# Altium schematic sheet preamp.SchDoc
size Letter
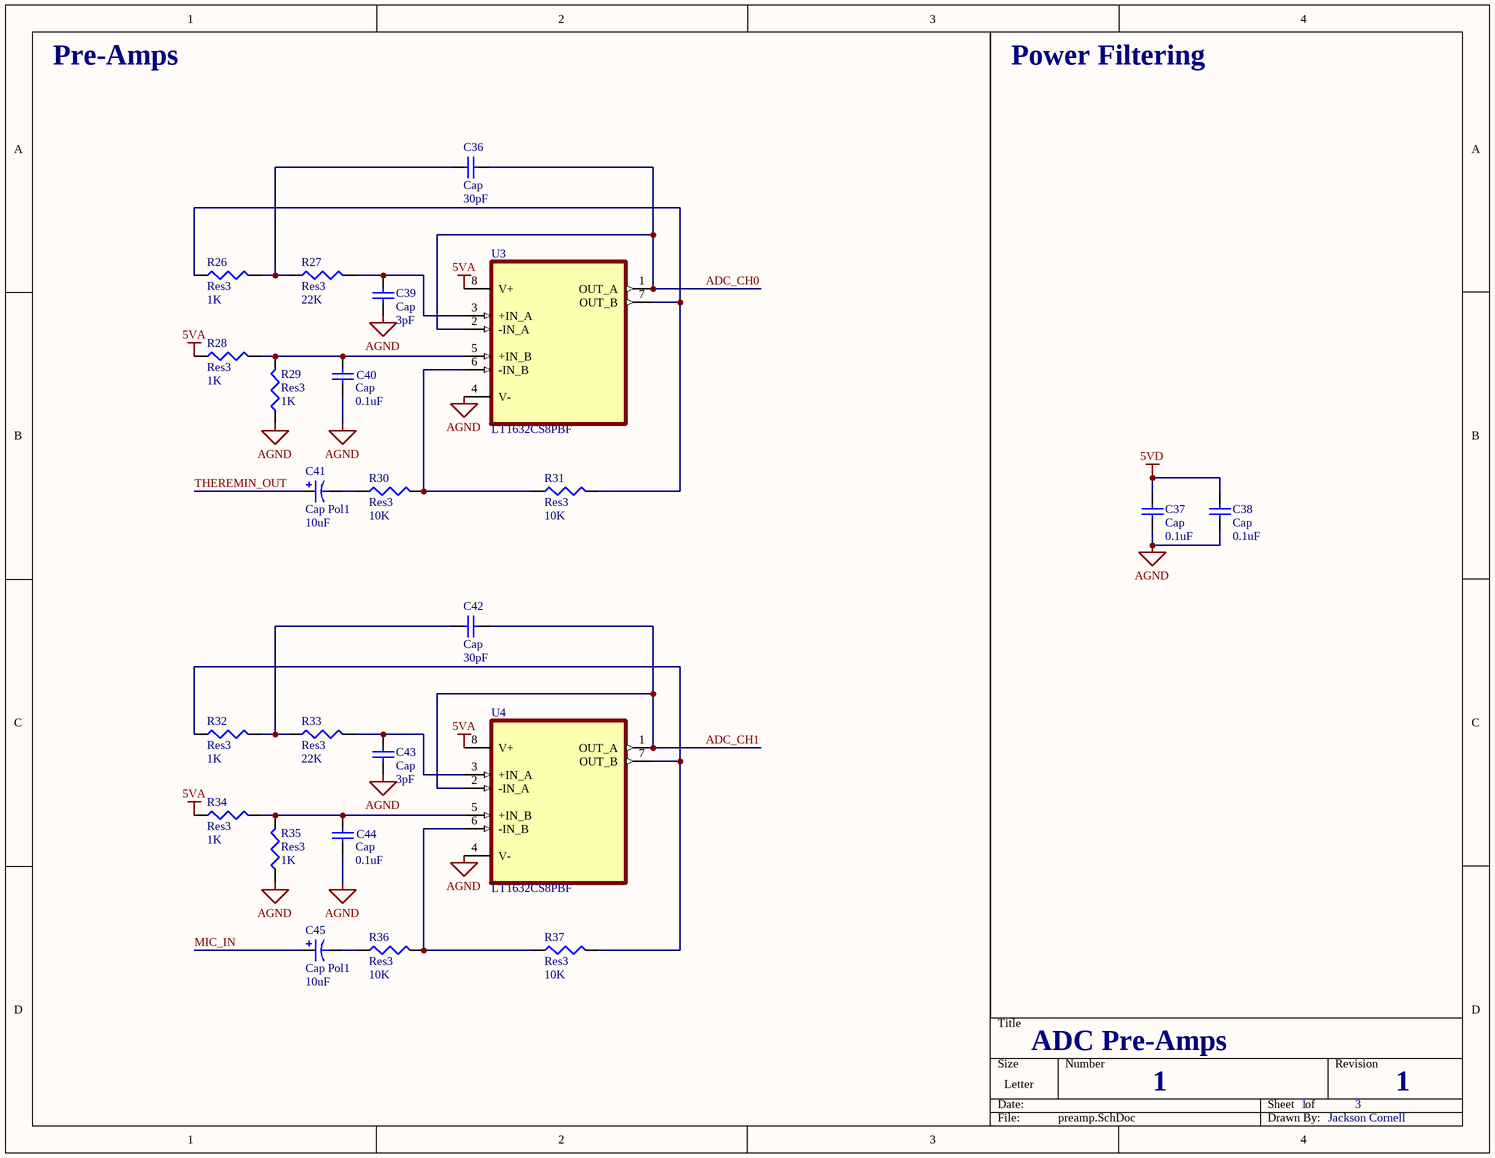
[diagram p0: preamp.SchDoc]

## Parts
C36  Cap  value 30pF  [CAPC0805]
C37  Cap  value 0.1uF  [CAPC0805]
C38  Cap  value 0.1uF  [CAPC0805]
C39  Cap  value 3pF  [CAPC0805]
C40  Cap  value 0.1uF  [CAPC0805]
C41  Cap Pol1  value 10uF  [CAPC0805]
C42  Cap  value 30pF  [CAPC0805]
C43  Cap  value 3pF  [CAPC0805]
C44  Cap  value 0.1uF  [CAPC0805]
C45  Cap Pol1  value 10uF  [RES0805]
R26  Res3  value 1K  [RES0805]
R27  Res3  value 22K  [RES0805]
R28  Res3  value 1K  [RES0805]
R29  Res3  value 1K  [RES0805]
R30  Res3  value 10K  [RES0805]
R31  Res3  value 10K  [RES0805]
R32  Res3  value 1K  [RES0805]
R33  Res3  value 22K  [RES0805]
R34  Res3  value 1K  [RES0805]
R35  Res3  value 1K  [RES0805]
R36  Res3  value 10K  [RES0805]
R37  Res3  value 10K  [RES0805]
U3  LT1632CS8PBF  [SOIC127P600X175-8N]
U4  LT1632CS8PBF  [SOIC127P600X175-8N]

## Nets
5VA: R28.1 R34.1 U3.8(V+) U4.8(V+)
5VD: C37.2 C38.2
AGND: C37.1 C38.1 C39.1 C40.1 C43.1 C44.1 R29.1 R35.1 U3.4(V-) U4.4(V-)
ADC_CH0: C36.2 U3.1(OUT_A) U3.2(-IN_A)
ADC_CH1: C42.2 U4.1(OUT_A) U4.2(-IN_A)
MIC_IN: C45.1
THEREMIN_OUT: C41.1
NetC36_1: C36.1 R26.2 R27.1
NetC39_2: C39.2 R27.2 U3.3(+IN_A)
NetC40_2: C40.2 R28.2 R29.2 U3.5(+IN_B)
NetC41_2: C41.2 R30.1
NetC42_1: C42.1 R32.2 R33.1
NetC43_2: C43.2 R33.2 U4.3(+IN_A)
NetC44_2: C44.2 R34.2 R35.2 U4.5(+IN_B)
NetC45_2: C45.2 R36.1
NetR26_1: R26.1 R31.2 U3.7(OUT_B)
NetR30_2: R30.2 R31.1 U3.6(-IN_B)
NetR32_1: R32.1 R37.2 U4.7(OUT_B)
NetR36_2: R36.2 R37.1 U4.6(-IN_B)

## Notes on the sheet
- Pre-Amps
- Power Filtering
- ADC Pre-Amps
- 1
- 3
- Jackson Cornell

## Library data of the parts
C36-C40 C42-C44 = Cap: Capacitor; Published: 8-Jun-2000; LatestRevisionDate: 17-Jul-2002; LatestRevisionNote: Re-released for DXP Platform.; PackageReference: RAD-0.3; Publisher: Altium Limited; PackageDescription: Radial Cap, Thru-Hole; 2 Leads; 0.3 in Pin Spacing
C41 C45 = Cap Pol1: Polarized Capacitor (Radial); Published: 8-Jun-2000; LatestRevisionDate: 17-Jul-2002; LatestRevisionNote: Re-released for DXP Platform.; PackageReference: RB7.6-15; Publisher: Altium Limited; PackageDescription: Polarized Capacitor (Radial); 2 Leads
R26-R37 = Res3: Resistor; Published: 8-Jun-2000; LatestRevisionDate: 29-May-2009; LatestRevisionNote: IPC-7351 Footprint Added.; PackageReference: J1-0603; Publisher: Altium Limited; PackageDescription: Chip Resistor
U3 U4 = LT1632CS8PBF: 45MHz, 45V/ms, Dual/Quad Rail-to-Rail Input and Output  Precision Op Amps; Package: None; Price: None; Value: *; MP: LT1632CS8PBF; Availability: Unavailable